# EAGLE schematic power_supply (EAGLE 7.6.0)
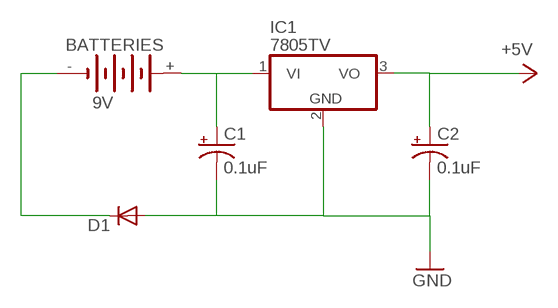
[diagram p0: schematic, sheet 1]

## Parts
BATTERIES  VMS4V8  [VMS4V8]
C1  0.1uF  CPOL-US085CS-1AW  [085CS_1AW]
C2  0.1uF  CPOL-US085CS-1AW  [085CS_1AW]
D1  1N4007  [1N4007STANDING]
IC1  7805TV  [TO220V]

## Nets
+5V: C2.+ IC1.3(VO)
GND: C1.- C2.- D1.A IC1.2(GND)
N$1: BATTERIES.+ C1.+ IC1.1(VI)
N$2: BATTERIES.- D1.C

## Library data of the parts
BATTERIES = battery:VMS4V8: NC ACCU Varta Mempac S 4V8; VOLTAGE: 9V
C1 C2 = rcl:CPOL-US: POLARIZED CAPACITOR, American symbol
D1 = personal:1N4007
IC1 = linear:78*: Positive VOLTAGE REGULATOR Source: http://cache.national.com/ds/LM/LM78L05.pdf http://www.fairchildsemi.com/ds/LM/LM7805.pdf